# Altium schematic sheet 01-Block-Diagram.SchDoc: Block Diagram
size 420 x 297 mm; Author: Dmitry Shpakov; Organization: NoName; Revision: Revision; PageSize: A3; ProjectName: Project Name
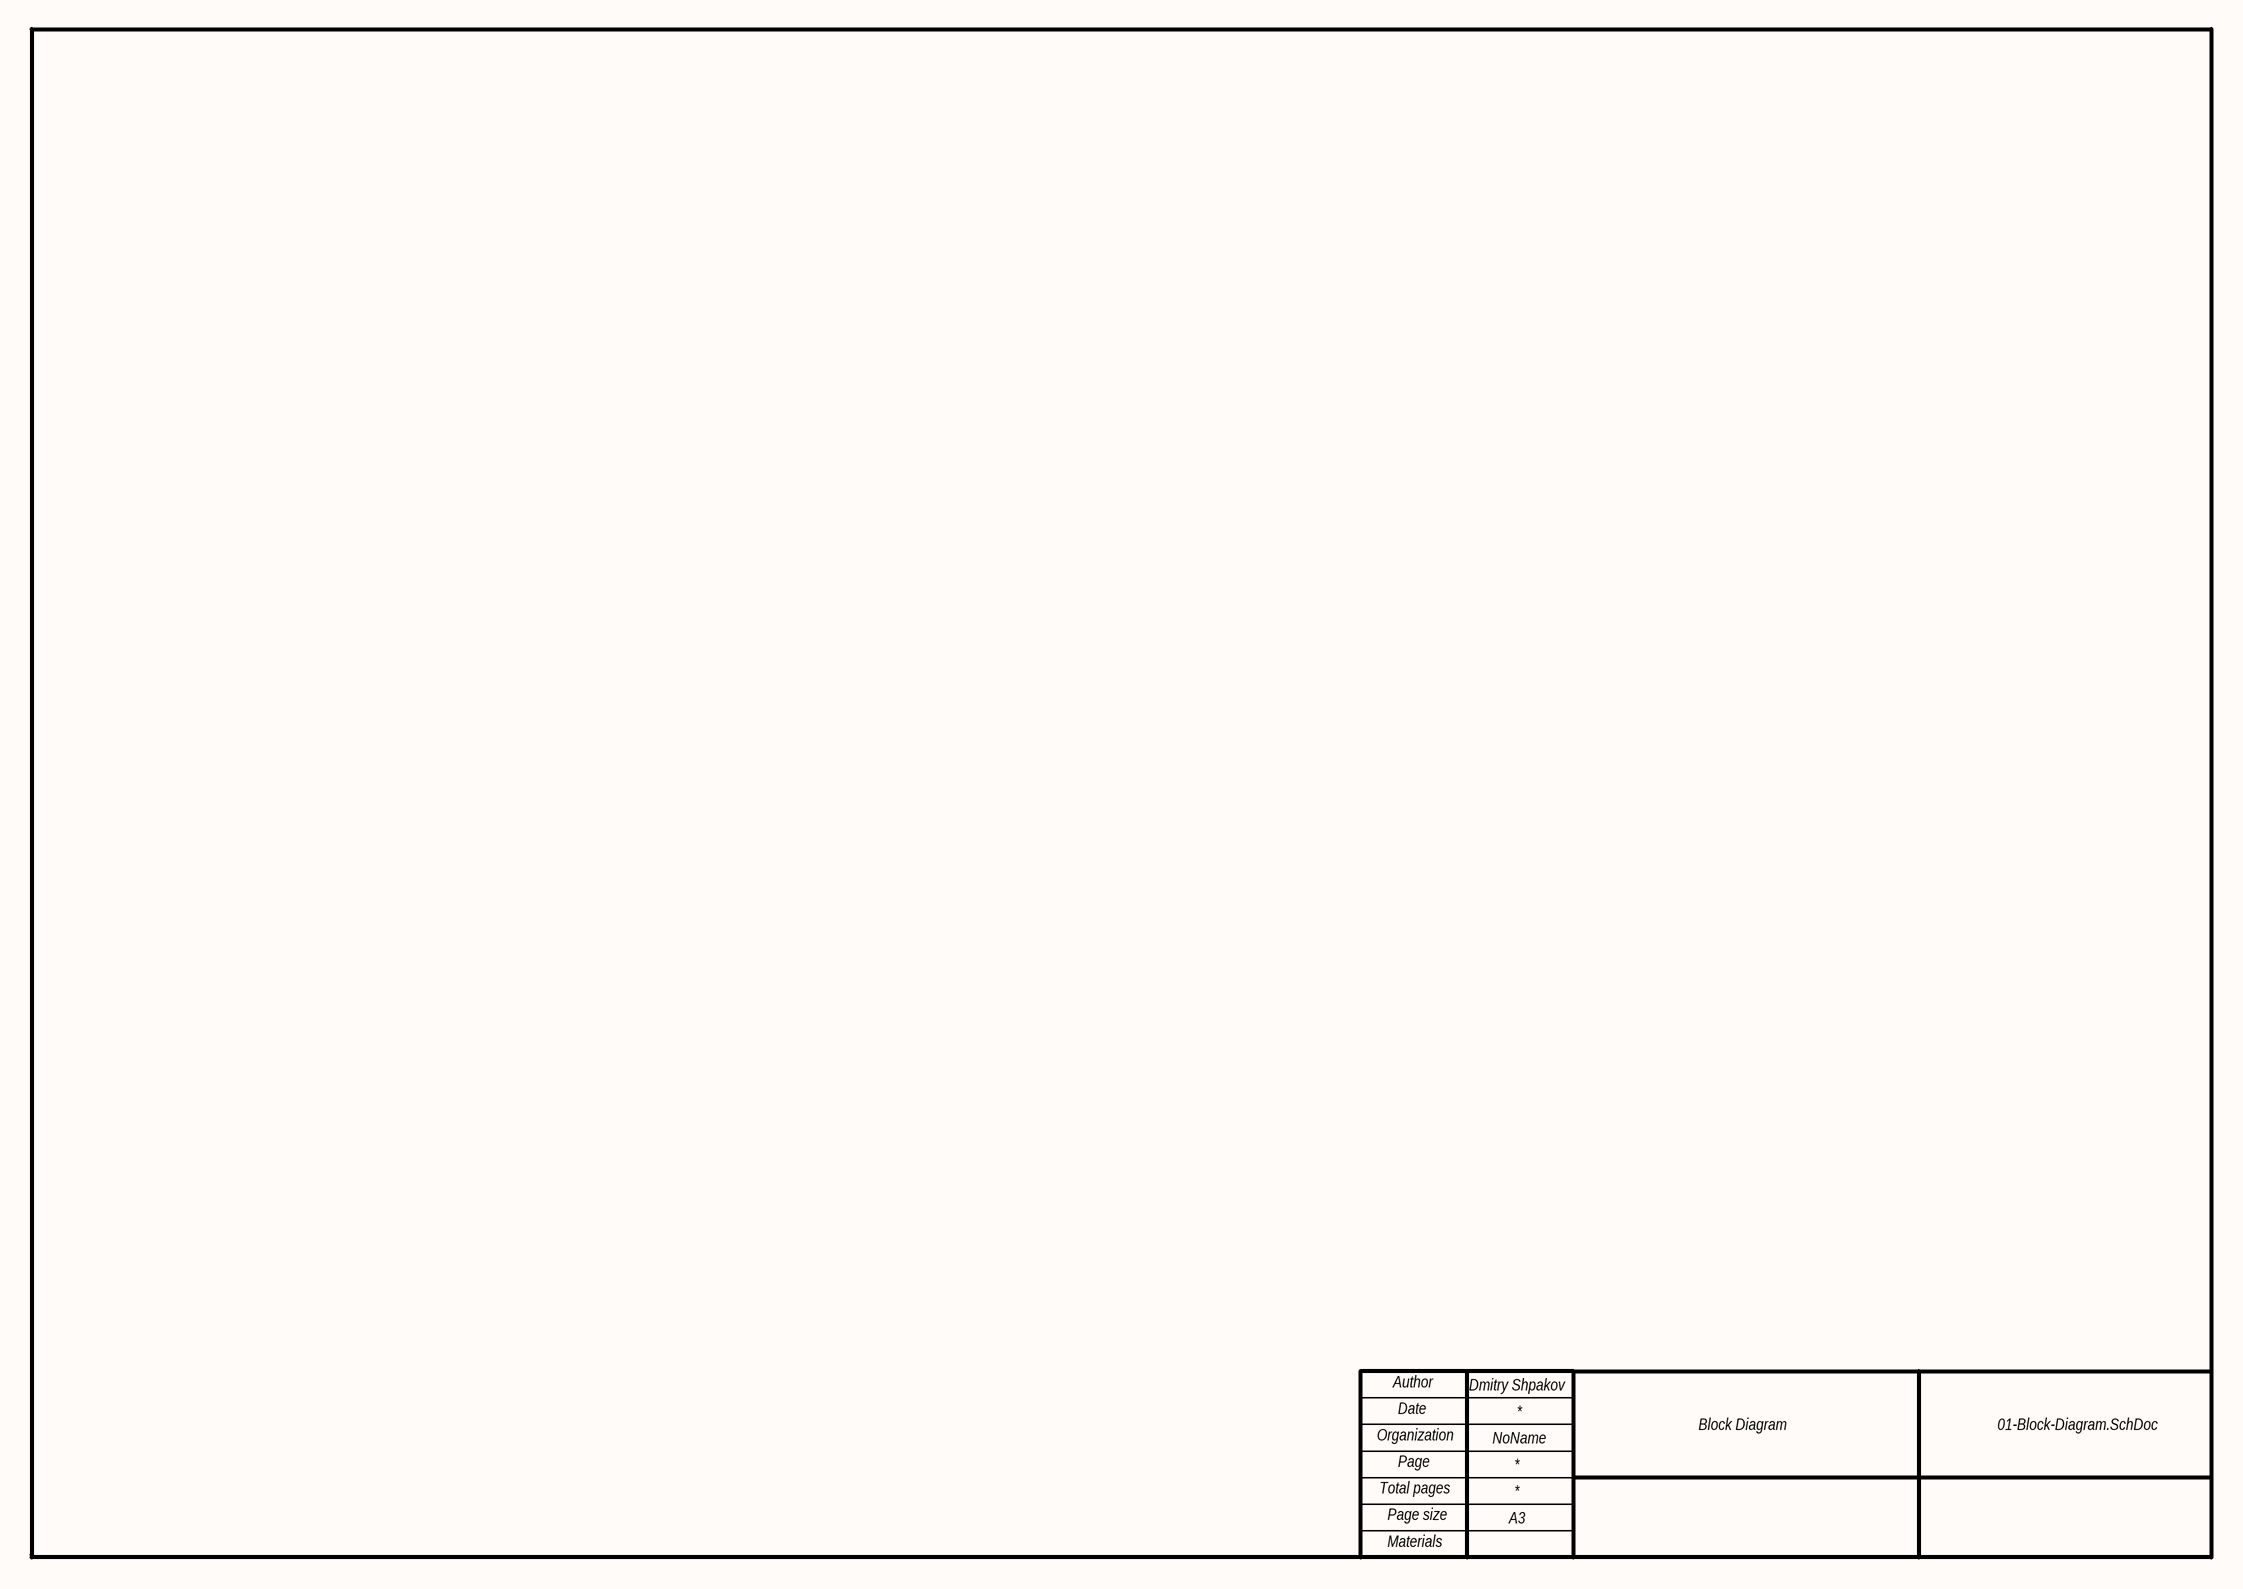
[diagram p0: 01-Block-Diagram.SchDoc]

## Notes on the sheet
- Author
- Organization
- Date
- Page
- Total pages
- Page size
- Materials